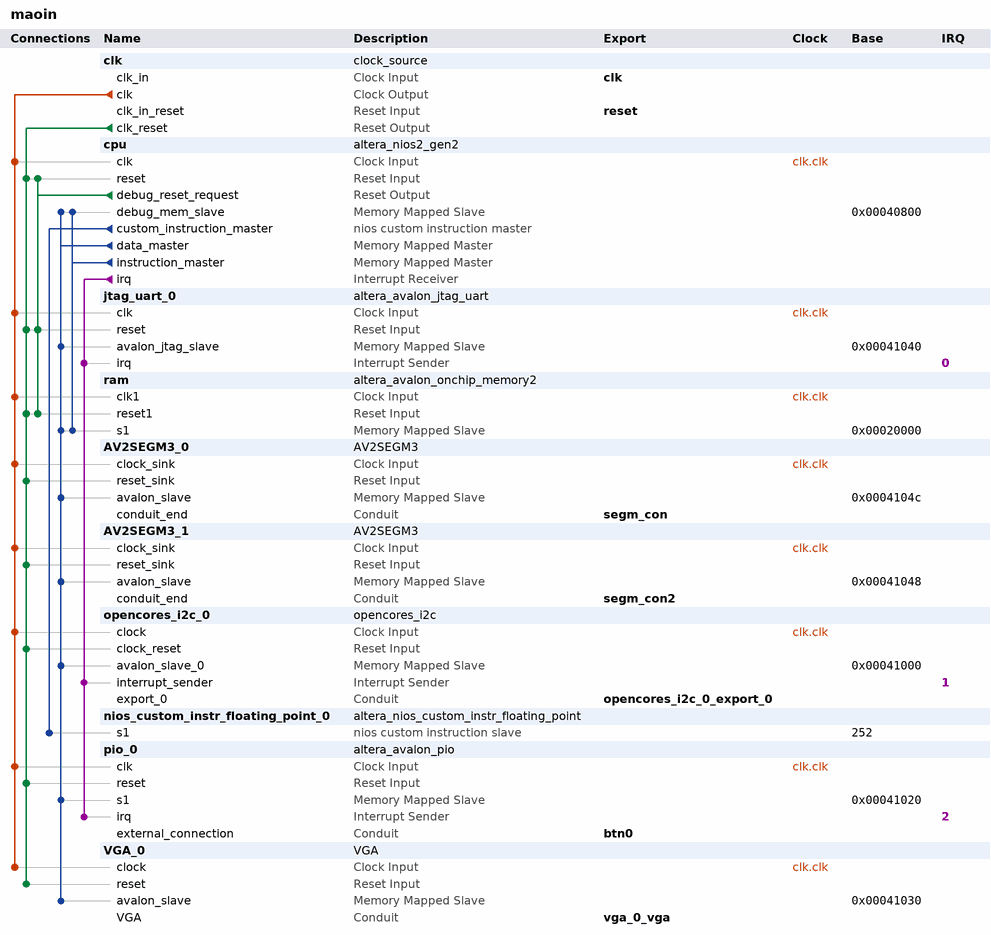
[diagram p0: system contents]
# Platform Designer (Qsys) system maoin, MAX 10 10M50DAF484C7G
# Parameters at their usual value, and those the tool derives, are not listed.
package require -exact qsys 20.1
create_system maoin
set_project_property DEVICE_FAMILY {MAX 10}
set_project_property DEVICE 10M50DAF484C7G

add_instance clk clock_source 20.1
set_instance_parameter_value clk clockFrequency 50000000

add_instance cpu altera_nios2_gen2 20.1
set_instance_parameter_value cpu dcache_size 2048
set_instance_parameter_value cpu exceptionSlave ram.s1
set_instance_parameter_value cpu icache_size 4096
set_instance_parameter_value cpu impl Tiny
set_instance_parameter_value cpu mul_64_impl 1
set_instance_parameter_value cpu mul_shift_choice 1
set_instance_parameter_value cpu resetSlave ram.s1

add_instance jtag_uart_0 altera_avalon_jtag_uart 20.1
set_instance_parameter_value jtag_uart_0 simInteractiveOptions NO_INTERACTIVE_WINDOWS

add_instance ram altera_avalon_onchip_memory2 20.1
set_instance_parameter_value ram dataWidth 32
set_instance_parameter_value ram dualPort false
set_instance_parameter_value ram initMemContent false
set_instance_parameter_value ram initializationFileName onchip_mem.hex
set_instance_parameter_value ram memorySize 100000

add_instance AV2SEGM3_0 AV2SEGM3 1.0

add_instance AV2SEGM3_1 AV2SEGM3 1.0

add_instance opencores_i2c_0 opencores_i2c 9.1

add_instance nios_custom_instr_floating_point_0 altera_nios_custom_instr_floating_point 20.1

add_instance pio_0 altera_avalon_pio 20.1
set_instance_parameter_value pio_0 bitClearingEdgeCapReg true
set_instance_parameter_value pio_0 captureEdge true
set_instance_parameter_value pio_0 direction Input
set_instance_parameter_value pio_0 generateIRQ true
set_instance_parameter_value pio_0 irqType EDGE
set_instance_parameter_value pio_0 width 1

add_instance VGA_0 VGA 1.0

# connections
add_connection clk.clk AV2SEGM3_0.clock_sink clock
add_connection clk.clk AV2SEGM3_1.clock_sink clock
add_connection clk.clk cpu.clk clock
add_connection clk.clk jtag_uart_0.clk clock
add_connection clk.clk opencores_i2c_0.clock clock
add_connection clk.clk pio_0.clk clock
add_connection clk.clk ram.clk1 clock
add_connection clk.clk VGA_0.clock clock
add_connection clk.clk_reset AV2SEGM3_0.reset_sink reset
add_connection clk.clk_reset AV2SEGM3_1.reset_sink reset
add_connection clk.clk_reset cpu.reset reset
add_connection clk.clk_reset jtag_uart_0.reset reset
add_connection clk.clk_reset opencores_i2c_0.clock_reset reset
add_connection clk.clk_reset pio_0.reset reset
add_connection clk.clk_reset ram.reset1 reset
add_connection clk.clk_reset VGA_0.reset reset
add_connection cpu.debug_reset_request cpu.reset reset
add_connection cpu.debug_reset_request jtag_uart_0.reset reset
add_connection cpu.debug_reset_request ram.reset1 reset
add_connection cpu.data_master AV2SEGM3_0.avalon_slave avalon
set_connection_parameter_value cpu.data_master/AV2SEGM3_0.avalon_slave baseAddress 0x0004104c
add_connection cpu.data_master AV2SEGM3_1.avalon_slave avalon
set_connection_parameter_value cpu.data_master/AV2SEGM3_1.avalon_slave baseAddress 0x00041048
add_connection cpu.data_master cpu.debug_mem_slave avalon
set_connection_parameter_value cpu.data_master/cpu.debug_mem_slave baseAddress 0x00040800
add_connection cpu.data_master jtag_uart_0.avalon_jtag_slave avalon
set_connection_parameter_value cpu.data_master/jtag_uart_0.avalon_jtag_slave baseAddress 0x00041040
add_connection cpu.data_master opencores_i2c_0.avalon_slave_0 avalon
set_connection_parameter_value cpu.data_master/opencores_i2c_0.avalon_slave_0 baseAddress 0x00041000
add_connection cpu.data_master pio_0.s1 avalon
set_connection_parameter_value cpu.data_master/pio_0.s1 baseAddress 0x00041020
add_connection cpu.data_master ram.s1 avalon
set_connection_parameter_value cpu.data_master/ram.s1 baseAddress 0x00020000
add_connection cpu.data_master VGA_0.avalon_slave avalon
set_connection_parameter_value cpu.data_master/VGA_0.avalon_slave baseAddress 0x00041030
add_connection cpu.instruction_master cpu.debug_mem_slave avalon
set_connection_parameter_value cpu.instruction_master/cpu.debug_mem_slave baseAddress 0x00040800
add_connection cpu.instruction_master ram.s1 avalon
set_connection_parameter_value cpu.instruction_master/ram.s1 baseAddress 0x00020000
add_connection cpu.irq jtag_uart_0.irq interrupt
set_connection_parameter_value cpu.irq/jtag_uart_0.irq irqNumber 0
add_connection cpu.irq opencores_i2c_0.interrupt_sender interrupt
set_connection_parameter_value cpu.irq/opencores_i2c_0.interrupt_sender irqNumber 1
add_connection cpu.irq pio_0.irq interrupt
set_connection_parameter_value cpu.irq/pio_0.irq irqNumber 2
add_connection cpu.custom_instruction_master nios_custom_instr_floating_point_0.s1 nios_custom_instruction
set_connection_parameter_value cpu.custom_instruction_master/nios_custom_instr_floating_point_0.s1 CIName nios_custom_instr_floating_point_0
set_connection_parameter_value cpu.custom_instruction_master/nios_custom_instr_floating_point_0.s1 baseAddress 252

# exported interfaces
add_interface btn0 conduit end
set_interface_property btn0 EXPORT_OF pio_0.external_connection
add_interface clk clock sink
set_interface_property clk EXPORT_OF clk.clk_in
add_interface opencores_i2c_0_export_0 conduit end
set_interface_property opencores_i2c_0_export_0 EXPORT_OF opencores_i2c_0.export_0
add_interface reset reset sink
set_interface_property reset EXPORT_OF clk.clk_in_reset
add_interface segm_con conduit end
set_interface_property segm_con EXPORT_OF AV2SEGM3_0.conduit_end
add_interface segm_con2 conduit end
set_interface_property segm_con2 EXPORT_OF AV2SEGM3_1.conduit_end
add_interface vga_0_vga conduit end
set_interface_property vga_0_vga EXPORT_OF VGA_0.VGA

set_interconnect_requirement {$system} qsys_mm.clockCrossingAdapter HANDSHAKE
set_interconnect_requirement {$system} qsys_mm.enableEccProtection FALSE
set_interconnect_requirement {$system} qsys_mm.insertDefaultSlave FALSE
set_interconnect_requirement {$system} qsys_mm.maxAdditionalLatency 1

save_system maoin.qsys
